# Altium project Final_Project.PrjPcb
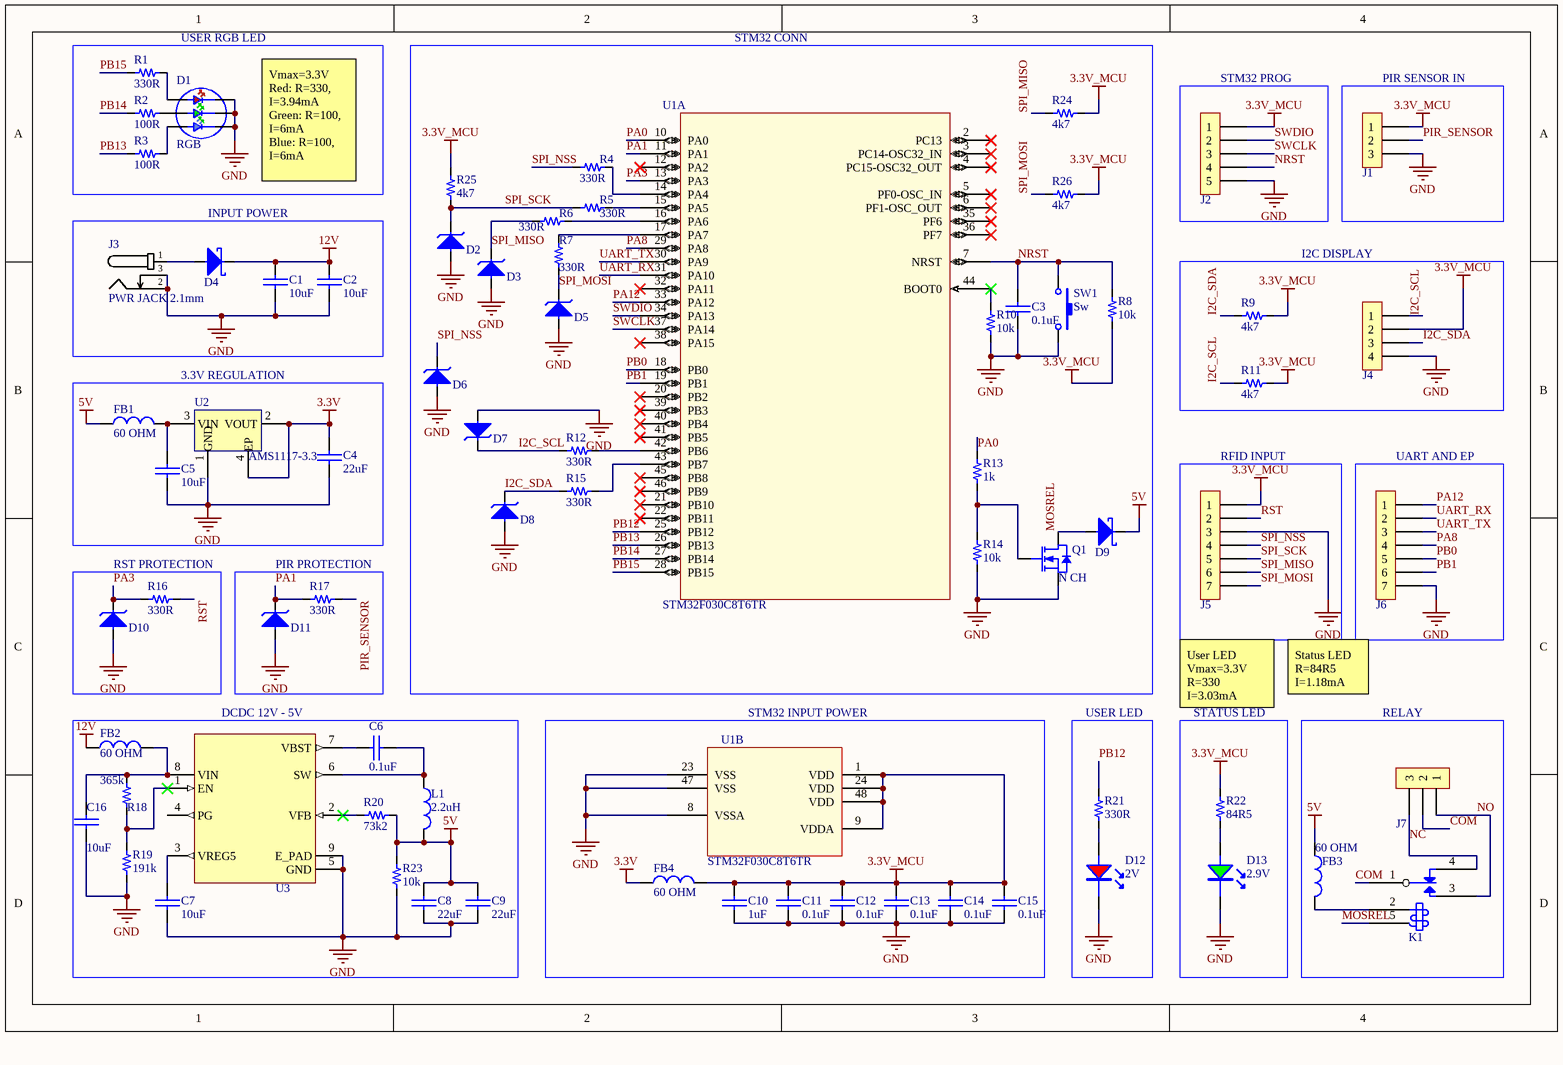
[diagram p0: Final_Project.SchDoc]
1 sheet, 73 parts. Net scope: global (net labels, ports and power ports of the same name join across sheets).
Board file: Final_Project.PcbDoc

## Sheet Final_Project.SchDoc
size A4; SheetNumber: 1; SheetTotal: 1

### Parts
C1  value 10uF  [0805_cap]  (hidden comment: 10uF 25V)
C2  value 10uF  [0805_cap]  (hidden comment: 10uF 25V)
C3  value 0.1uF  [0603_cap]  (hidden comment: 0.1uF 50V)
C4  value 22uF  [0603_cap]  (hidden comment: 22uF 10V)
C5  value 10uF  [0805_cap]  (hidden comment: 10uF 25V)
C6  value 0.1uF  [0603_cap]  (hidden comment: 0.1uF 50V)
C7  value 10uF  [0603_cap]  (hidden comment: 10uF 10V)
C8  value 22uF  [0805_cap]  (hidden comment: 22uF 16V)
C9  value 22uF  [0805_cap]  (hidden comment: 22uF 16V)
C10  value 1uF  [0603_cap]  (hidden comment: 1uF 50V)
C11  value 0.1uF  [0603_cap]  (hidden comment: 0.1uF 50V)
C12  value 0.1uF  [0603_cap]  (hidden comment: 0.1uF 50V)
C13  value 0.1uF  [0603_cap]  (hidden comment: 0.1uF 50V)
C14  value 0.1uF  [0603_cap]  (hidden comment: 0.1uF 50V)
C15  value 0.1uF  [0603_cap]  (hidden comment: 0.1uF 50V)
C16  value 10uF  [0805_cap]  (hidden comment: 10uF 25V)
D1  RGB  [RGB_NS_3.5X3.7]
D2  TVS_3V3_1CH_SOD_523  [SOD_523]  (value not drawn)
D3  TVS_3V3_1CH_SOD_523  [SOD_523]  (value not drawn)
D4  30V 3A  [SMA]  (value not drawn)
D5  TVS_3V3_1CH_SOD_523  [SOD_523]  (value not drawn)
D6  TVS_3V3_1CH_SOD_523  [SOD_523]  (value not drawn)
D7  TVS_3V3_1CH_SOD_523  [SOD_523]  (value not drawn)
D8  TVS_3V3_1CH_SOD_523  [SOD_523]  (value not drawn)
D9  30V 3A  [SMA]  (value not drawn)
D10  TVS_3V3_1CH_SOD_523  [SOD_523]  (value not drawn)
D11  TVS_3V3_1CH_SOD_523  [SOD_523]  (value not drawn)
D12  2V  [0805_LED]
D13  2.9V  [0805_LED]
FB1  value 60 OHM  [0603_fb]  (hidden comment: 60OHM 2A)
FB2  value 60 OHM  [0603_fb]  (hidden comment: 60OHM 2A)
FB3  value 60 OHM  [0603_fb]  (hidden comment: 60OHM 2A)
FB4  value 60 OHM  [0603_fb]  (hidden comment: 60OHM 2A)
J1  3x1  [H_3X1_TH_100mil]  (value not drawn)  (no BOM)
J2  5x1  [H_5x1_TH_100mil]  (value not drawn)  (no BOM)
J3  PWR JACK 2.1mm  [CON_POWER_BARREL_2.1MM_3CONN]
J4  4x1  [H_4x1_TH_2.54mm]  (value not drawn)  (no BOM)
J5  7x1  [H_7x1_TH_100mil]  (value not drawn)  (no BOM)
J6  7x1  [H_7x1_TH_100mil]  (value not drawn)  (no BOM)
J7  3x1  [H_3X1_TH_100mil]  (value not drawn)  (no BOM)
K1  V_15A  [Relay_5V_15A]  (value not drawn)
L1  value 2.2uH  [Ind_5.8*5.2_NS]  (hidden comment: 2.2uH 4A)
Q1  N CH  [SOT_23_3]
R1  value 330R  [0603_res]  (hidden comment: 330R 1/10W)
R2  value 100R  [0603_res]  (hidden comment: 100R 1/10W)
R3  value 100R  [0603_res]  (hidden comment: 100R 1/10W)
R4  value 330R  [0603_res]  (hidden comment: 330R 1/10W)
R5  value 330R  [0603_res]  (hidden comment: 330R 1/10W)
R6  value 330R  [0603_res]  (hidden comment: 330R 1/10W)
R7  value 330R  [0603_res]  (hidden comment: 330R 1/10W)
R8  value 10k  [0603_res]  (hidden comment: 10k 1/10W)
R9  value 4k7  [0603_res]  (hidden comment: 4k7 1/10W)
R10  value 10k  [0603_res]  (hidden comment: 10k 1/10W)
R11  value 4k7  [0603_res]  (hidden comment: 4k7 1/10W)
R12  value 330R  [0603_res]  (hidden comment: 330R 1/10W)
R13  value 1k  [0603_res]  (hidden comment: 1k 1/10W)
R14  value 10k  [0603_res]  (hidden comment: 10k 1/10W)
R15  value 330R  [0603_res]  (hidden comment: 330R 1/10W)
R16  value 330R  [0603_res]  (hidden comment: 330R 1/10W)
R17  value 330R  [0603_res]  (hidden comment: 330R 1/10W)
R18  value 365k  [0603_res]  (hidden comment: 365k 1/10W)
R19  value 191k  [0603_res]  (hidden comment: 191k 1/10W)
R20  value 73k2  [0603_res]  (hidden comment: 73k2 1/10W)
R21  value 330R  [0603_res]  (hidden comment: 330R 1/10W)
R22  value 84R5  [0603_res]  (hidden comment: 84R5 1/10W)
R23  value 10k  [0603_res]  (hidden comment: 10k 1/10W)
R24  value 4k7  [0603_res]  (hidden comment: 4k7 1/10W)
R25  value 4k7  [0603_res]  (hidden comment: 4k7 1/10W)
R26  value 4k7  [0603_res]  (hidden comment: 4k7 1/10W)
SW1  Sw  [Sw_PUSH_4.5x4.5x5mm]
U1  STM32F030C8T6TR  [LQFP48_7x7mm]  (parts A,B of 2)
U2  AMS1117-3.3  [SOT_223]
U3  TPS56528DDAR  [SOIC_8_3.9mm_EP]  (value not drawn)

### Blocks framed on the sheet
USER RGB LED: D1 R1-R3
STM32 CONN: C3 D2 D3 D5-D9 Q1 R4-R8 R10 R12-R15 R24-R26 SW1 U1
STM32 PROG: J2
PIR SENSOR IN: J1
INPUT POWER: C1 C2 D4 J3
I2C DISPLAY: J4 R9 R11
3.3V REGULATION: C4 C5 FB1 U2
RFID INPUT: J5
UART AND EP: J6
RST PROTECTION: D10 R16
PIR PROTECTION: D11 R17
DCDC 12V - 5V: C6-C9 C16 FB2 L1 R18-R20 R23 U3
STM32 INPUT POWER: C10-C15 FB4 U1
USER LED: D12 R21
STATUS LED: D13 R22
RELAY: FB3 J7 K1

### Nets
3.3V: C4.1 FB4.1 U2.2(VOUT) U2.4(EP)
3.3V_MCU: C10.1 C11.1 C12.1 C13.1 C14.1 C15.1 FB4.2 J1.1 J2.1 J4.2 J5.1 R8.1 R9.2 R11.1 R22.2 R24.2 R25.2 R26.2 U1.1(VDD) U1.9(VDDA) U1.24(VDD) U1.48(VDD)
5V: C8.1 C9.1 D9.1 FB1.1 FB3.1 L1.2 R20.2 R23.2
12V: C1.1 C2.1 D4.1 FB2.1
GND: C1.2 C2.2 C3.2 C4.2 C5.2 C7.2 C8.2 C9.2 C10.2 C11.2 C12.2 C13.2 C14.2 C15.2 C16.2 D1.1 D1.2 D1.3 D2.2 D3.2 D5.2 D6.2 D7.2 D8.2 D10.2 D11.2 D12.2 D13.2 J1.3 J2.5 J3.2 J3.3 J4.4 J5.3 J6.7 Q1.2(S) R10.1 R14.1 R19.1 R23.1 SW1.2 U1.8(VSSA) U1.23(VSS) U1.47(VSS) U2.1(GND) U3.5(GND) U3.9(E_PAD)
COM: J7.2 K1.1
I2C_SCL: D7.1 J4.1 R11.2 R12.1
I2C_SDA: D8.1 J4.3 R9.1 R15.1
MOSREL: D9.2 K1.5 Q1.3(D)
NC: J7.3 K1.4
NO: J7.1 K1.3
NRST: C3.1 J2.4 R8.2 SW1.1 U1.7(NRST)
PA0: R13.2 U1.10(PA0)
PA1: D11.1 R17.1 U1.11(PA1)
PA3: D10.1 R16.1 U1.13(PA3)
PA8: J6.4 U1.29(PA8)
PA12: J6.1 U1.33(PA12)
PB0: J6.5 U1.18(PB0)
PB1: J6.6 U1.19(PB1)
PB12: R21.2 U1.25(PB12)
PB13: R3.1 U1.26(PB13)
PB14: R2.1 U1.27(PB14)
PB15: R1.1 U1.28(PB15)
PIR_SENSOR: J1.2 R17.2
RST: J5.2 R16.2
SPI_MISO: D3.1 J5.6 R6.1 R24.1
SPI_MOSI: D5.1 J5.7 R7.1 R26.1
SPI_NSS: D6.1 J5.4 R4.1
SPI_SCK: D2.1 J5.5 R5.1 R25.1
SWCLK: J2.3 U1.37(PA14)
SWDIO: J2.2 U1.34(PA13)
UART_RX: J6.2 U1.31(PA10)
UART_TX: J6.3 U1.30(PA9)
NetC5_1: C5.1 FB1.2 U2.3(VIN)
NetC6_1: C6.1 U3.7(VBST)
NetC6_2: C6.2 L1.1 U3.6(SW)
NetC7_1: C7.1 U3.3(VREG5)
NetC16_1: C16.1 FB2.2 R18.2 U3.8(VIN)
NetD1_4: D1.4 R1.2
NetD1_5: D1.5 R2.2
NetD1_6: D1.6 R3.2
NetD4_2: D4.2 J3.1
NetD12_1: D12.1(A) R21.1
NetD13_1: D13.1(A) R22.1
NetFB3_2: FB3.2 K1.2
NetQ1_1: Q1.1(G) R13.1 R14.2
NetR4_2: R4.2 U1.14(PA4)
NetR5_2: R5.2 U1.15(PA5)
NetR6_2: R6.2 U1.16(PA6)
NetR7_2: R7.2 U1.17(PA7)
NetR10_2: R10.2 U1.44(BOOT0)
NetR12_2: R12.2 U1.42(PB6)
NetR15_2: R15.2 U1.43(PB7)
NetR18_1: R18.1 R19.2 U3.1(EN)
NetR20_1: R20.1 U3.2(VFB)

Not connected (* = marked no-connect by the designer): U1 2(PC13)* 3(PC14-OSC32_IN)* 4(PC15-OSC32_OUT)* 5(PF0-OSC_IN)* 6(PF1-OSC_OUT)* 12(PA2)* 20(PB2)* 21(PB10)* 22(PB11)* 32(PA11)* 35(PF6)* 36(PF7)* 38(PA15)* 39(PB3)* 40(PB4)* 41(PB5)* 45(PB8)* 46(PB9)*; U3 4(PG)

### Notes on the sheet
- (near D1) Vmax=3.3V
  Red: R=330, I=3.94mA
  Green: R=100, I=6mA
  Blue: R=100, I=6mA
- User LED
  Vmax=3.3V
  R=330
  I=3.03mA
- Status LED
  R=84R5
  I=1.18mA

### Library data of the parts
C1 C2 C5 C16 = Cap_10uF_0805_25V_: 25V 10uF X5R ±10% 0805 Multilayer Ceramic Capacitors MLCC - SMD/SMT ROHS; Manufacturer: Samsung Electro-Mechanics; Manufacturer Part Number: CL21A106KAYNNNE; Supplier 1: LCSC; Supplier Part Number 1: C15850; ComponentLink1Description: LCSC; ComponentLink1URL: https://lcsc.com/product-detail/Multilayer-Ceramic-Capacitors-MLCC-SMD-SMT_Samsung-Electro-Mechanics-CL21A106KAYNNNE_C15850.html
C3 C6 C11-C15 = Cap_0.1uF_0603_50V: 50V 100nF Y5V -20%~+80% 0603 Multilayer Ceramic Capacitors MLCC - SMD/SMT ROHS; Manufacturer: Walsin Tech Corp; Manufacturer Part Number: 0603F104Z500CT; Supplier 1: LCSC; Supplier Part Number 1: C83060; ComponentLink1Description: LCSC; ComponentLink1URL: https://www.lcsc.com/product-detail/Multilayer-Ceramic-Capacitors-MLCC-SMD-SMT_Walsin-Tech-Corp-0603F104Z500CT_C83060.html
C4 = Cap_22uF_0603_10V: 10V 22uF X5R ±20% 0603 Multilayer Ceramic Capacitors MLCC - SMD/SMT ROHS; Manufacturer: HRE; Manufacturer Part Number: CGA0603X5R226M100JT; Supplier 1: LCSC; Supplier Part Number 1: C6119863; ComponentLink1Description: LCSC; ComponentLink1URL: https://lcsc.com/product-detail/Multilayer-Ceramic-Capacitors-MLCC-SMD-SMT_HRE-CGA0603X5R226M100JT_C6119863.html
C7 = Cap_10uF_0603_10V: 10V 10uF X5R ±10% 0603 Multilayer Ceramic Capacitors MLCC - SMD/SMT ROHS; Manufacturer: CCTC; Manufacturer Part Number: TCC0603X5R106K100CT; Supplier 1: LCSC; Supplier Part Number 1: C380314; ComponentLink1Description: LCSC; ComponentLink1URL: https://www.lcsc.com/product-detail/Multilayer-Ceramic-Capacitors-MLCC-SMD-SMT_CCTC-TCC0603X5R106K100CT_C380314.html
C8 C9 = Cap_22uF_0805_16V: 16V 22uF X5R ±20% 0805 Multilayer Ceramic Capacitors MLCC - SMD/SMT ROHS; Manufacturer: Chinocera; Manufacturer Part Number: HGC0805R5226M160NSLJ; Supplier 1: LCSC; Supplier Part Number 1: C33546008; ComponentLink1Description: LCSC; ComponentLink1URL: https://lcsc.com/product-detail/Multilayer-Ceramic-Capacitors-MLCC-SMD-SMT_Chinocera-HGC0805R5226M160NSLJ_C33546008.html
C10 = Cap_1uF_0603_50V: 50V 1uF X5R ±10% 0603 Multilayer Ceramic Capacitors MLCC - SMD/SMT ROHS; Manufacturer: Samsung Electro-Mechanics; Manufacturer Part Number: CL10A105KB8NNNC; Supplier 1: LCSC; Supplier Part Number 1: C15849; ComponentLink1Description: LCSC; ComponentLink1URL: https://www.lcsc.com/product-detail/Multilayer-Ceramic-Capacitors-MLCC-SMD-SMT_Samsung-Electro-Mechanics-CL10A105KB8NNNC_C15849.html
D1 = LED_RGB_3535_SMD: -30℃~+85℃ RGB 110° 3535(mm) Light Emitting Diodes (LED) ROHS; Manufacturer: Foshan NationStar Optoelectronics; Manufacturer Part Number: RS-3535MWAM; Supplier 1: LCSC; Supplier Part Number 1: C842778; ComponentLink1Description: LCSC; ComponentLink1URL: https://www.lcsc.com/product-detail/Light-Emitting-Diodes-LED_Foshan-NationStar-Optoelectronics-RS-3535MWAM_C842778.html
D2 D3 D5-D8 D10 D11 = TVS_3V3_1CH_SOD_523: 11.2A@8/20us 200W@8/20us 14.1V 5V Unidirectional 3.3V SOD-523 ESD and Surge Protection (TVS/ESD) ROHS; Manufacturer: LRC; Manufacturer Part Number: LESD5Z3.3T1G; Supplier 1: LCSC; Supplier Part Number 1: C136161; ComponentLink1Description: LCSC; ComponentLink1URL: https://lcsc.com/product-detail/ESD-and-Surge-Protection-TVS-ESD_LRC-LESD5Z3-3T1G_C136161.html
D4 D9 = D_Schottky_40V_3A_SMA: 40V Independent 3A 550mV@3A SMA Schottky Diodes ROHS; Manufacturer: TDSEMIC; Manufacturer Part Number: SS34-TD; Supplier 1: LCSC; Supplier Part Number 1: C46550832; ComponentLink1Description: LCSC; ComponentLink1URL: https://lcsc.com/product-detail/Schottky-Diodes_TDSEMIC-SS34-TD_C46550832.html
D12 = LED_0805_RED: LED RED CLEAR 0805 SMD; Manufacturer: XINGLIGHT; Manufacturer Part Number: XL-2012SURC; Supplier 1: LCSC; Supplier Part Number 1: C965812; ComponentLink1Description: LCSC; ComponentLink1URL: https://www.lcsc.com/product-detail/Light-Emitting-Diodes-LED_XINGLIGHT-XL-2012SURC_C965812.html
D13 = LED_0805_Green: LED GREEN CLEAR 0805 SMD; Manufacturer: XINGLIGHT; Manufacturer Part Number: XL-2012UGC; Supplier 1: LCSC; Supplier Part Number 1: C965815; ComponentLink1Description: LCSC; ComponentLink1URL: https://www.lcsc.com/product-detail/Light-Emitting-Diodes-LED_XINGLIGHT-XL-2012UGC_C965815.html
FB1-FB4 = FB_60_0603_2A: 2A 1 100mΩ 60Ω@100MHz ±25% 0603 Ferrite Beads ROHS; Manufacturer: TAI-TECH; Manufacturer Part Number: HCB1608KF-600T20; ComponentLink1Description: LCSC; ComponentLink1URL: https://www.lcsc.com/product-detail/Ferrite-Beads_TAI-TECH-HCB1608KF-600T20_C369516.html; Supplier 1: LCSC; Supplier Part Number 1: C369516
J1 J7 = H_Male_3x1_TH_100mil: ComponentLink1Description: LCSC
J2 = H_Male_5x1_TH_100mil: ComponentLink1Description: LCSC
J3 = Con_Power_Jack_2.1mm_3pins: CONN PWR JACK 2X5.5MM SOLDER; Manufacturer: HCTL; Manufacturer Part Number: HC-DC-005-2.0T; Supplier 1: LCSC; Supplier Part Number 1: C3010533; ComponentLink1Description: LCSC; ComponentLink1URL: https://www.lcsc.com/product-detail/AC-DC-Power-Connectors_HCTL-HC-DC-005-2-0T_C3010533.html
J4 = H_Male_4x1_TH_100mil: ComponentLink1Description: LCSC
J5 J6 = H_Male_7x1_TH_100mil: ComponentLink1Description: LCSC
K1 = Relay_5V_15A: 250V@AC 5V 15A 1 Form C: 1C (SPDT-CO) Plugin,15.6x19.2mm Power Relays ROHS; Manufacturer: Ningbo Songle Relay; Manufacturer Part Number: SRD-05VDC-SL-C; Supplier 1: LCSC; Supplier Part Number 1: C35449; ComponentLink1Description: LCSC; ComponentLink1URL: https://lcsc.com/product-detail/Power-Relays_Ningbo-Songle-Relay-SRD-05VDC-SL-C_C35449.html
L1 = Inductor_2.2uH_4A_5.8*5.2mm: 4A 2.2uH ±20% 22.1mΩ SMD,5.8x5.2mm Inductors (SMD) ROHS; Manufacturer: SHOU HAN; Manufacturer Part Number: CY54-2.2UH; Supplier 1: LCSC; Supplier Part Number 1: C2929427; ComponentLink1Description: LCSC; ComponentLink1URL: https://lcsc.com/product-detail/Inductors-SMD_SHOU-HAN-CY54-2-2UH_C2929427.html
Q1 = Q_NFET_20V_3.2A_SOT23: MOSFET N-CH 20V SOT23; Manufacturer: Doeshare; Manufacturer Part Number: DN2302S; Supplier 1: LCSC; Supplier Part Number 1: C2931750; ComponentLink1Description: LCSC; ComponentLink1URL: https://www.lcsc.com/product-detail/MOSFETs_Doeshare-DN2302S_C2931750.html
R1 R4-R7 R12 R15-R17 R21 = Res_330R_0603_1/10W: RES SMD 330R OHM 5% 1/10W 0603; Manufacturer: FOJAN; Manufacturer Part Number: FRC0603J331 TS; ComponentLink1URL: https://www.lcsc.com/product-detail/Chip-Resistor-Surface-Mount_FOJAN-FRC0603J331-TS_C2907152.html; Supplier 1: LCSC; Supplier Part Number 1: C2907152; ComponentLink1Description: LCSC
R2 R3 = Res_100R_0603_1/10W: RES SMD 100R OHM 5% 1/10W 0603; Manufacturer: FOJAN; Manufacturer Part Number: FRC0603J101 TS; ComponentLink1URL: https://www.lcsc.com/product-detail/Chip-Resistor-Surface-Mount_FOJAN-FRC0603J101-TS_C2907089.html; Supplier 1: LCSC; Supplier Part Number 1: C2907089; ComponentLink1Description: LCSC
R8 R10 R14 R23 = Res_10k_0603_1/10W: RES SMD 10k OHM 5% 1/10W 0603; Manufacturer: FOJAN; Manufacturer Part Number: FRC0603J103TS; ComponentLink1URL: https://www.lcsc.com/product-detail/Chip-Resistor-Surface-Mount_FOJAN-FRC0603J103TS_C2930027.html; Supplier 1: LCSC; Supplier Part Number 1: C2930027; ComponentLink1Description: LCSC
R9 R11 R24-R26 = Res_4k7_0603_1/10W: 100mW Thick Film Resistor 75V ±1% 4.7kΩ 0603 Chip Resistor - Surface Mount ROHS; Manufacturer: VO; Manufacturer Part Number: SCR0603F4K7; ComponentLink1URL: https://lcsc.com/product-detail/Chip-Resistor-Surface-Mount_VO-SCR0603F4K7_C3016318.html; Supplier 1: LCSC; Supplier Part Number 1: C3016318; ComponentLink1Description: LCSC
R13 = Res_1k_0603_1/10W: RES SMD 1k OHM 5% 1/10W 0603; Manufacturer: FOJAN; Manufacturer Part Number: FRC0603J102 TS; ComponentLink1URL: https://www.lcsc.com/product-detail/Chip-Resistor-Surface-Mount_FOJAN-FRC0603J102-TS_C2907113.html; Supplier 1: LCSC; Supplier Part Number 1: C2907113; ComponentLink1Description: LCSC
R18 = Res_365k_0603_1/10W: 100mW Thick Film Resistor 75V ±100ppm/℃ ±1% 365kΩ 0603 Chip Resistor - Surface Mount ROHS; Manufacturer: YAGEO; Manufacturer Part Number: RC0603FR-07365KL; ComponentLink1URL: https://lcsc.com/product-detail/Chip-Resistor-Surface-Mount_YAGEO-RC0603FR-07365KL_C185336.html; Supplier 1: LCSC; Supplier Part Number 1: C185336; ComponentLink1Description: LCSC
R19 = Res_191k_0603_1/10W: 100mW Thick Film Resistor 75V ±100ppm/℃ ±1% 191kΩ 0603 Chip Resistor - Surface Mount ROHS; Manufacturer: YAGEO; Manufacturer Part Number: AC0603FR-07191KL; ComponentLink1URL: https://lcsc.com/product-detail/Chip-Resistor-Surface-Mount_YAGEO-AC0603FR-07191KL_C227635.html; Supplier 1: LCSC; Supplier Part Number 1: C227635; ComponentLink1Description: LCSC
R20 = Res_73k2_0603_1/10W: 100mW Thick Film Resistor 75V ±100ppm/℃ ±1% 73.2kΩ 0603 Chip Resistor - Surface Mount ROHS; Manufacturer: YAGEO; Manufacturer Part Number: RC0603FR-0773K2L; ComponentLink1URL: https://lcsc.com/product-detail/Chip-Resistor-Surface-Mount_YAGEO-RC0603FR-0773K2L_C163420.html; Supplier 1: LCSC; Supplier Part Number 1: C163420; ComponentLink1Description: LCSC
R22 = Res_84R5_0603_1/10W: 100mW Thick Film Resistor 50V ±100ppm/℃ ±1% 84.5Ω 0603 Chip Resistor - Surface Mount ROHS; Manufacturer: LIZ Elec; Manufacturer Part Number: CR0603FA84R5G; ComponentLink1URL: https://lcsc.com/product-detail/Chip-Resistor-Surface-Mount_LIZ-Elec-CR0603FA84R5G_C101216.html; Supplier 1: LCSC; Supplier Part Number 1: C101216; ComponentLink1Description: LCSC
SW1 = Sw_PUSH_4.5x4.5x5.0xmm: SWITCH TACTILE SPST-NO 0.05A 12V; Manufacturer: BZCN; Manufacturer Part Number: TSC015A05026A; Supplier 1: LCSC; Supplier Part Number 1: C2888509; Last modified by: N-A.Potosi; Last modified date: 20190222; ComponentLink1Description: LCSC; ComponentLink1URL: https://www.lcsc.com/product-detail/Tactile-Switches_BZCN-TSC015A05026A_C2888509.html
U1 = IC_STM32F030C8T6TR_LQFP48_7x7MM: IC MCU 32BIT 64KB FLASH 48LQFP; Manufacturer: STMicroelectronics; Manufacturer part number: STM32F030C8T6TR; Supplier 1: LCSC; Supplier Part Number 1: C23922; ComponentLink1Description: LCSC; ComponentLink1URL: https://www.lcsc.com/product-detail/ST-Microelectronics_STMicroelectronics-STM32F030C8T6_C23922.html
U2 = LDO_3V3_1A_FIXED: 1A 60dB@(120Hz) Fixed 3.3V Positive 18V SOT-223 Linear Voltage Regulators (LDO) ROHS; Manufacturer: UMW(Youtai Semiconductor Co., Ltd.); ComponentLink1Description: LCSC; ComponentLink1URL: https://www.lcsc.com/product-detail/_UMW-Youtai-Semiconductor-Co-Ltd-_C347222.html; Supplier 1: LCSC; Manufacturer Part Number: AMS1117-3.3; Supplier Part Number 1: C347222
U3 = DCDC_SW_BUCK_5A_SOIC8: IC REG BUCK ADJ 5A 8SOPWR; Manufacturer: Texas Instruments; Manufacturer Part Number: TPS56528DDAR; Supplier 1: LCSC; Supplier Part Number 1: C138716; ComponentLink1Description: LCSC; ComponentLink1URL: https://lcsc.com/product-detail/DC-DC-Converters_Texas-Instruments-TPS56528DDAR_C138716.html